# Altium schematic sheet USB Type C Connector ESD.SchDoc: USB Type C Connector
size Tabloid; ApprovedBy: NA; CompanyName: Cospan Design LLC; DrawnBy: Dave McCoy; Engineer: Dave McCoy; DocumentNumber: 11; Revision: A; SheetNumber: 11; SheetTotal: 20; Client: Public; Project: Enigma; ProjectPrettyName: Enigma
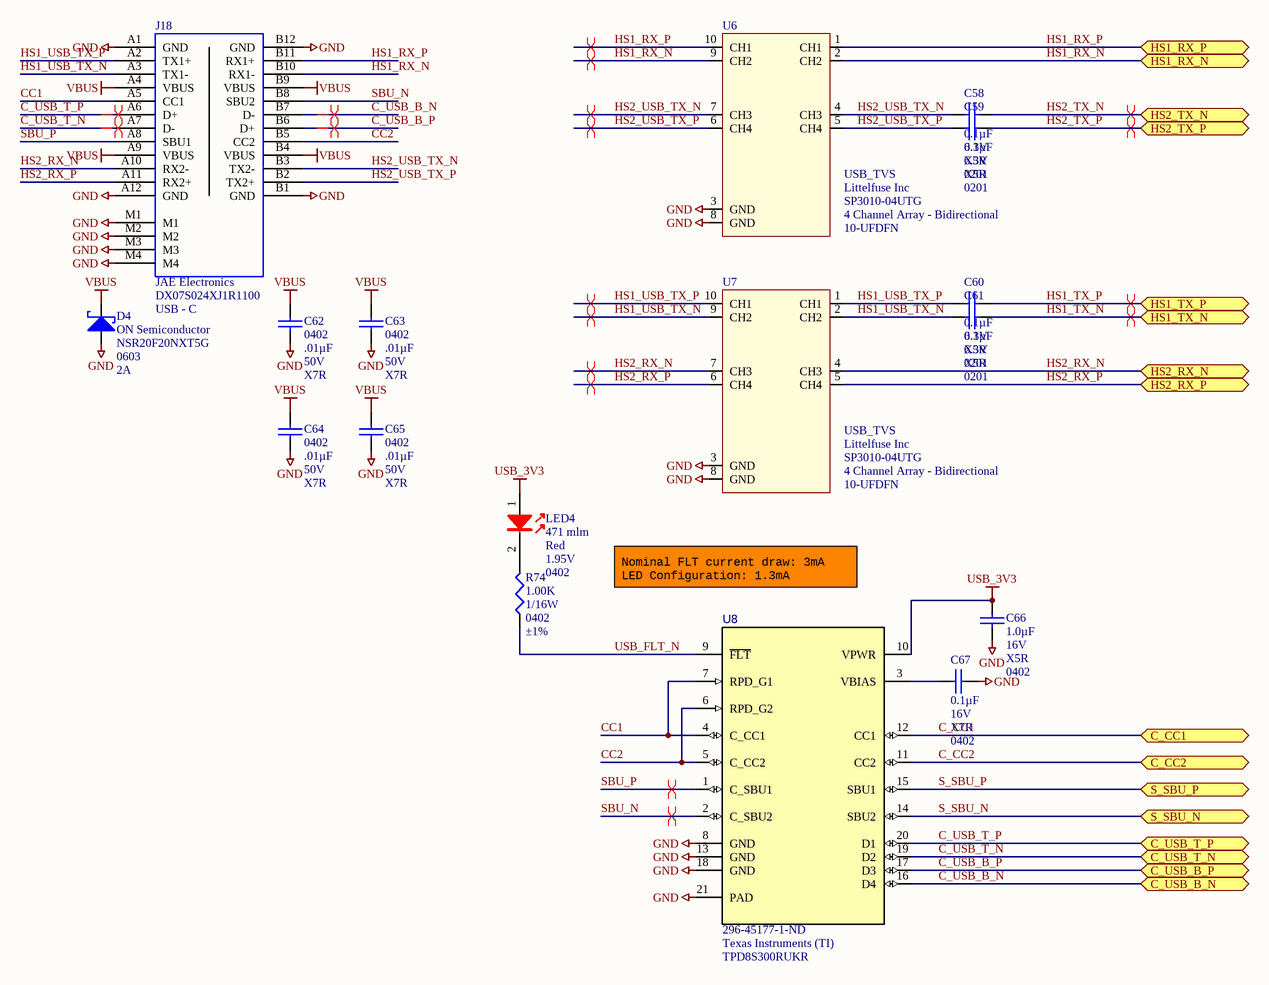
[diagram p0: USB Type C Connector ESD.SchDoc]

## Parts
C58  Capacitance: 0.1µF  Voltage - Rated: 6.3V  Temperature Coefficient: X5R  Package / Case: 0201  [CAPC0201]  (hidden comment: 0.1UF)
C59  Capacitance: 0.1µF  Voltage - Rated: 6.3V  Temperature Coefficient: X5R  Package / Case: 0201  [CAPC0201]  (hidden comment: 0.1UF)
C60  Capacitance: 0.1µF  Voltage - Rated: 6.3V  Temperature Coefficient: X5R  Package / Case: 0201  [CAPC0201]  (hidden comment: 0.1UF)
C61  Capacitance: 0.1µF  Voltage - Rated: 6.3V  Temperature Coefficient: X5R  Package / Case: 0201  [CAPC0201]  (hidden comment: 0.1UF)
C62  Package / Case: 0402  Capacitance: .01µF  Voltage - Rated: 50V  Temperature Coefficient: X7R  [C_0402]  (hidden comment: 10000pF)
C63  Package / Case: 0402  Capacitance: .01µF  Voltage - Rated: 50V  Temperature Coefficient: X7R  [C_0402]  (hidden comment: 10000pF)
C64  Package / Case: 0402  Capacitance: .01µF  Voltage - Rated: 50V  Temperature Coefficient: X7R  [C_0402]  (hidden comment: 10000pF)
C65  Package / Case: 0402  Capacitance: .01µF  Voltage - Rated: 50V  Temperature Coefficient: X7R  [C_0402]  (hidden comment: 10000pF)
C66  Capacitance: 1.0µF  Voltage - Rated: 16V  Temperature Coefficient: X5R  Package / Case: 0402  [C_ERA-0402]  (hidden comment: 1.0uF)
C67  Capacitance: 0.1µF  Voltage - Rated: 16V  Temperature Coefficient: X7R  Package / Case: 0402  [C_0402]  (hidden comment: 0.1uF)
D4  Manufacturer: ON Semiconductor  Manufacturer Part Number: NSR20F20NXT5G  Case/Package: 0603  Average Rectified Current: 2A  [DSN2_0603]  (hidden comment: D_SCHOTT_30V_2A_XDFN)
J18  Manufacturer: JAE Electronics  Connector Type: USB - C  [DX07S024XJ1R1100]  (hidden comment: J_DX07S024XJ1R1100)
LED4  Luminous Flux @ Current - Test: 471 mlm  Color: Red  Voltage - Forward (Vf) Typ: 1.95V  Package / Case: 0402  [DIOM1005X07L_RED]  (hidden comment: LED_RED_0402)
R74  Resistance In Ohms: 1.00K  Power (Watts): 1/16W  Case: 0402  Tolerance: ±1%  [R_0402]  (hidden comment: 1.0k Ohms)
U6  USB_TVS  Manufacturer: Littelfuse Inc  Manufacturer Part Number: SP3010-04UTG  Polarization: 4 Channel Array - Bidirectional  Package / Case: 10-UFDFN  [TVS_DIODE_USB3.0-10]
U7  USB_TVS  Manufacturer: Littelfuse Inc  Manufacturer Part Number: SP3010-04UTG  Polarization: 4 Channel Array - Bidirectional  Package / Case: 10-UFDFN  [TVS_DIODE_USB3.0-10]
U8  Supplier Part Number 1: 296-45177-1-ND  Manufacturer: Texas Instruments (TI)  Manufacturer Part Number: TPD8S300RUKR  [RUK0020B]  (hidden comment: U_TPD8S300RUK)

## Ports
C_CC1, C_CC2, C_USB_B_N, C_USB_B_P, C_USB_T_N, C_USB_T_P, HS1_RX_N, HS1_RX_P, HS1_TX_N, HS1_TX_P, HS2_RX_N, HS2_RX_P, HS2_TX_N, HS2_TX_P, S_SBU_N, S_SBU_P

## Nets
GND: C62.1 C63.1 C64.1 C65.1 C66.1 C67.1 D4.2(A) J18.A1(GND) J18.A12(GND) J18.B1(GND) J18.B12(GND) J18.M1 J18.M2 J18.M3 J18.M4 U6.3(GND) U6.8(GND) U7.3(GND) U7.8(GND) U8.8(GND) U8.13(GND) U8.18(GND) U8.21(PAD)
USB_3V3: C66.2 LED4.1 U8.10(VPWR)
VBUS: C62.2 C63.2 C64.2 C65.2 D4.1(C) J18.A4(VBUS) J18.A9(VBUS) J18.B4(VBUS) J18.B9(VBUS)
C_CC1: U8.12(CC1) ; port C_CC1
C_CC2: U8.11(CC2) ; port C_CC2
C_USB_B_N: J18.B7(D-) U8.16(D4) ; port C_USB_B_N
C_USB_B_P: J18.B6(D+) U8.17(D3) ; port C_USB_B_P
C_USB_T_N: J18.A7(D-) U8.19(D2) ; port C_USB_T_N
C_USB_T_P: J18.A6(D+) U8.20(D1) ; port C_USB_T_P
CC1: J18.A5(CC1) U8.4(C_CC1) U8.7(RPD_G1)
CC2: J18.B5(CC2) U8.5(C_CC2) U8.6(RPD_G2)
HS1_RX_N: J18.B10(RX1-) U6.2(CH2) U6.9(CH2) ; port HS1_RX_N
HS1_RX_P: J18.B11(RX1+) U6.1(CH1) U6.10(CH1) ; port HS1_RX_P
HS1_TX_N: C61.2 ; port HS1_TX_N
HS1_TX_P: C60.2 ; port HS1_TX_P
HS1_USB_TX_N: C61.1 J18.A3(TX1-) U7.2(CH2) U7.9(CH2)
HS1_USB_TX_P: C60.1 J18.A2(TX1+) U7.1(CH1) U7.10(CH1)
HS2_RX_N: J18.A10(RX2-) U7.4(CH3) U7.7(CH3) ; port HS2_RX_N
HS2_RX_P: J18.A11(RX2+) U7.5(CH4) U7.6(CH4) ; port HS2_RX_P
HS2_TX_N: C58.2 ; port HS2_TX_N
HS2_TX_P: C59.2 ; port HS2_TX_P
HS2_USB_TX_N: C58.1 J18.B3(TX2-) U6.4(CH3) U6.7(CH3)
HS2_USB_TX_P: C59.1 J18.B2(TX2+) U6.5(CH4) U6.6(CH4)
S_SBU_N: U8.14(SBU2) ; port S_SBU_N
S_SBU_P: U8.15(SBU1) ; port S_SBU_P
SBU_N: J18.B8(SBU2) U8.2(C_SBU2)
SBU_P: J18.A8(SBU1) U8.1(C_SBU1)
USB_FLT_N: R74.2 U8.9(~{FLT})
NetC67_2: C67.2 U8.3(VBIAS)
NetLED4_2: LED4.2 R74.1

## Layout directives
differential pair: C_USB_B_N, C_USB_B_P, C_USB_T_N, C_USB_T_P, HS1_RX_N, HS1_RX_P, HS1_TX_N, HS1_TX_P, HS1_USB_TX_N, HS1_USB_TX_P, HS2_RX_N, HS2_RX_P, HS2_TX_N, HS2_TX_P, HS2_USB_TX_N, HS2_USB_TX_P, SBU_N, SBU_P

## Notes on the sheet
- Nominal FLT current draw: 3mA
  LED Configuration: 1.3mA
- Project:
- http://www.cospandesign.com
- Cospan Design
- Document:
- Engineer:
- Title:
- Client:
- Approved By:
- Revision:
- Date:
- Number:
- of

## Library data of the parts
C58-C61 = C_0201_0.1UF: CAP CER 0.1UF 6.3V 10% X5R 0201; Manufacturer: Murata Electronics North America; Manufacturer Part Number: GRM033R60J104KE19D; Description: CAP CER 0.1UF 6.3V X5R 0201; Supplier 1: Digi-Key; Supplier Part Number 1: 490-3167-1-ND; RoHS: RoHS Compliant; Category: Capacitors; Stock 1: 13375857; Tolerance: ±10%; Mounting Type: Surface Mount, MLCC; Operating Temperature: -55°C ~ 85°C; Applications: General Purpose; Ratings: -; Size / Dimension: 0.024" L x 0.012" W (0.60mm x 0.30mm); Height - Seated (Max): -; Thickness (Max): 0.013" (0.33mm); Lead Spacing: -; Features: -; Packaging: Cut Tape (CT); Lead Style: -; ComponentLink1URL: http://search.murata.co.jp/Ceramy/image/img/A01X/G101/ENG/GRM033R60J104KE19-01.pdf; ComponentLink1Description: http://search.murata.co.jp/Ceramy/image/img/A01X/G101/ENG/GRM033R60J104KE19-01.pdf; Pricing 1: 1=0.1, 10=0.033, 100=0.0149, 500=0.01062, 1000=0.00835, 2500=0.00759, 5000=0.00698 (USD); Part Status: Active
C62-C65 = C_0402_10000PF_50V: CAP CERAMIC .01UF 50V X7R 0402; Manufacturer: Murata Electronics North America; Manufacturer Part Number: GRM155R71H103KA88D; Tolerance: ±10%; Supplier 1: Digi-Key; RoHS: RoHS Compliant; Category: Capacitors; Stock 1: 7255009; Pricing 1: 1=0.1, 50=0.0052, 100=0.0044, 250=0.00364, 500=0.00312, 1000=0.00242, 5000=0.00202 (USD); Packaging: Cut Tape (CT); Part Status: Active; Operating Temperature: -55°C ~ 125°C; Features: -; Ratings: -; Applications: General Purpose; Mounting Type: Surface Mount, MLCC; Size / Dimension: 0.039" L x 0.020" W (1.00mm x 0.50mm); Height - Seated (Max): -; Thickness (Max): 0.022" (0.55mm); Lead Spacing: -; Lead Style: -; ComponentLink1URL: http://www.murata.com/~/media/webrenewal/support/library/catalog/products/capacitor/mlcc/c02e.ashx; ComponentLink1Description: http://www.murata.com/~/media/webrenewal/support/library/catalog/products/capacitor/mlcc/c02e.ashx; Supplier Part Number 1: 490-4516-1-ND
C66 = C_0402_1.0UF_16V: CAP CER 1.0UF 16V X5R 0402; Manufacturer: Taiyo Yuden; Manufacturer Part Number: EMK105BJ105KV-F; Tolerance: ±10%; Description: CAP CER 1UF 16V X5R 0402; Supplier 1: Digi-Key; RoHS: RoHS Compliant; Category: Capacitors; Stock 1: 489909; Pricing 1: 1=0.1, 10=0.063, 100=0.028, 500=0.01998, 1000=0.0157, 2500=0.01427, 5000=0.01313 (USD); Packaging: Cut Tape (CT); Part Status: Active; Operating Temperature: -55°C ~ 85°C; Features: -; Ratings: -; Applications: General Purpose; Mounting Type: Surface Mount, MLCC; Size / Dimension: 0.039" L x 0.020" W (1.00mm x 0.50mm); Height - Seated (Max): -; Thickness (Max): 0.022" (0.55mm); Lead Spacing: -; Lead Style: -; ComponentLink1URL: http://ds.yuden.co.jp/TYCOMPAS/ut/detail.do?productNo=EMK105BJ105KV-F&fileName=EMK105BJ105KV-F_SS&mode=specSheetDownload; ComponentLink1Description: http://ds.yuden.co.jp/TYCOMPAS/ut/detail.do?productNo=EMK105BJ105KV-F&fileName=EMK105BJ105KV-F_SS&mode=specSheetDownload; Supplier Part Number 1: 587-2477-1-ND
C67 = C_0402_0.1UF_16V: CAP CER .10UF 16V X7R 0402; Manufacturer: Murata Electronics North America; Manufacturer Part Number: GRM155R71C104KA88J; Tolerance: ±10%; Description: CAP CER 0.1UF 16V X7R 0402; Supplier 1: Digi-Key; RoHS: RoHS Compliant; Category: Capacitors; Stock 1: 18103134; Pricing 1: 1=0.1, 10=0.014, 100=0.0062, 500=0.00442, 1000=0.00348, 2500=0.00316, 5000=0.00291 (USD); Packaging: Cut Tape (CT); Part Status: Active; Operating Temperature: -55°C ~ 125°C; Features: -; Ratings: -; Applications: General Purpose; Mounting Type: Surface Mount, MLCC; Size / Dimension: 0.039" L x 0.020" W (1.00mm x 0.50mm); Height - Seated (Max): -; Thickness (Max): 0.022" (0.55mm); Lead Spacing: -; ComponentLink1URL: http://www.murata.com/~/media/webrenewal/support/library/catalog/products/capacitor/mlcc/c02e.ashx?la=en-us; ComponentLink1Description: http://www.murata.com/~/media/webrenewal/support/library/catalog/products/capacitor/mlcc/c02e.ashx?la=en-us; Supplier Part Number 1: 490-6328-1-ND
D4 = D_SCHOTT_30V_2A_XDFN: Diode Schottky 30V 2A (DC) Surface Mount 2-DSN (1.6x.80); Description: DIODE SCHOTTKY 30V 2A 2DSN; Current - Average Rectified (Io): 2A (DC); Voltage - Forward (Vf) (Max) @ If: 480mV @ 2A; Speed: Fast Recovery =< 500ns, > 200mA (Io); Current - Reverse Leakage @ Vr: 150µA @ 30V; Supplier 1: Digi-Key; Stock 1: 19267; Pricing 1: 1=0.57, 10=0.458, 100=0.3118, 500=0.23386, 1000=0.17539 (USD); Packaging: Cut Tape (CT); ComponentLink1URL: http://www.onsemi.com/pub/Collateral/NSR20F30-D.PDF; ComponentLink1Description: http://www.onsemi.com/pub/Collateral/NSR20F30-D.PDF; Supplier Part Number 1: NSR20F30NXT5GOSCT-ND; RoHS: RoHS Compliant; Category: Discrete Semiconductor Products; Part Status: Active; Diode Type: Schottky; Capacitance @ Vr, F: -; Mounting Type: Surface Mount; Package / Case: 2-XDFN; Supplier Device Package: 2-DSN (1.6x.80); Operating Temperature - Junction: 150°C (Max)
J18 = J_DX07S024XJ1R1100: CONN RCPT USB C TOP MNT HYBRID; Number of Contacts: 24; Gender: Receptacle; Specifications: USB 3.1, Superspeed+; Supplier 1: Digi-Key; RoHS: RoHS Compliant; Category: Connectors, Interconnects; Stock 1: 1709; Pricing 1: 1=2.85, 10=2.587, 25=2.4288, 50=2.3232, 100=2.2176, 250=2.0064, 500=1.848 (USD); Packaging: Cut Tape (CT); Part Status: Active; Mounting Type: Surface Mount, Right Angle; Through Hole; Features: Board Guide; Ingress Protection: -; ComponentLink1URL: http://media.digikey.com/pdf/Data%20Sheets/JAE%20PDFs/DX07S024XJ1_Dwg.pdf; ComponentLink1Description: http://media.digikey.com/pdf/Data%20Sheets/JAE%20PDFs/DX07S024XJ1_Dwg.pdf; Supplier Part Number 1: 670-2848-1-ND; Manufacturer Part Number: DX07S024XJ1R1100
LED4 = LED_RED_0402: LED 1X0.5MM 630NM RD WTR CLR SMD; Manufacturer: Kingbright Corp; Manufacturer Part Number: APHHS1005SURCK; Current - Test: 20mA; Wavelength - Peak: 650nm; Millicandela Rating: 150mcd; Lens Type: Clear; Lens Style/Size: Rectangle, 0.8mm x 0.5mm; Viewing Angle: 120°; Supplier 1: Digi-Key; Supplier Part Number 1: 754-1104-1-ND; RoHS: RoHS Compliant; Category: Optoelectronics; Stock 1: 32842; Pricing 1: 1=0.3, 10=0.221, 25=0.1772, 100=0.1623, 250=0.14752, 500=0.13276, 1000=0.118 (USD); Wavelength - Dominant: 630nm; Mounting Type: Surface Mount; Packaging: Cut Tape (CT); ComponentLink1URL: http://www.us.kingbright.com/images/catalog/SPEC/APHHS1005SURCK.pdf; ComponentLink1Description: http://www.us.kingbright.com/images/catalog/SPEC/APHHS1005SURCK.pdf
R74 = R_0402_1.0K: RES 1.00K OHM 1/16W 1% 0402 SMD; Manufacturer: Yageo; Manufacturer Part Number: RC0402FR-071KL; Resistance (Ohms): 1K; Temperature Coefficient: ±100ppm/°C; Supplier 1: Digi-Key; Supplier Part Number 1: 311-1.00KLRCT-ND; RoHS: RoHS Compliant; Category: Resistors; Stock 1: 2103351; Pricing: 10=0.014, 100=0.0063, 500=0.00382, 1000=0.0027, 5000=0.00203 (USD); Composition: Thick Film; Features: -; Package / Case: 0402 (1005 Metric); Size / Dimension: 0.039" L x 0.020" W (1.00mm x 0.50mm); Height: 0.016" (0.40mm); Number of Terminations: 2; Packaging: Cut Tape (CT); ComponentLink1URL: http://www.yageo.com/documents/recent/PYu-RC0402_51_RoHS_L_6.pdf; ComponentLink1Description: http://www.yageo.com/documents/recent/PYu-RC0402_51_RoHS_L_6.pdf
U6 U7 = U_SP3010-04UTG: TVS ARRAY ESD 4CH .45PF 8KV UDFN; Voltage - Reverse Standoff (Typ): 6V; Supplier 1: Digi-Key; Supplier Part Number 1: F3507CT-ND; RoHS: RoHS Compliant; Category: Circuit Protection; Stock 1: 1559; Pricing: 1=0.99, 10=0.866, 25=0.7656, 100=0.6672, 250=0.5808, 500=0.4944, 1000=0.396 (USD); Voltage - Breakdown: -; Power (Watts): -; Mounting Type: Surface Mount; Supplier Device Package: 10-µDFN (2.5x1.0); Packaging: Cut Tape (CT); ComponentLink1URL: http://www.littelfuse.com/data/en/Data_Sheets/Littelfuse_TVS_Diode_Array_SPA_SP3010.pdf; ComponentLink1Description: http://www.littelfuse.com/data/en/Data_Sheets/Littelfuse_TVS_Diode_Array_SPA_SP3010.pdf
U8 = U_TPD8S300RUK: USB Type C Interface Protector: Short-to-VBUS Over Voltage and IEC 61000-4-2 ESD Protection, RUK0020B; Description: PRODUCTION DEVICE OF TPD8S300 US; Voltage - Clamping: 8V; Voltage - Working: 3.3V; Supplier 1: Digi-Key; Stock 1: 2504; Pricing 1: 1=2.65, 10=2.377, 100=1.9109, 500=1.56998, 1000=1.30084 (USD); RoHS: RoHS Compliant; Category: Circuit Protection; Packaging: Cut Tape (CT); Part Status: Active; Technology: Internal Switch; Applications: USB OTG; Mounting Type: Surface Mount; Package / Case: 20-WFQFN Exposed Pad; Supplier Device Package: 20-WQFN (3x3); Power (Watts): -; ComponentLink1URL: http://www.ti.com/lit/ds/symlink/tpd8s300.pdf; ComponentLink1Description: http://www.ti.com/lit/ds/symlink/tpd8s300.pdf